# EAGLE design atmel_midi_cv_2layer (EAGLE 8.3.2)
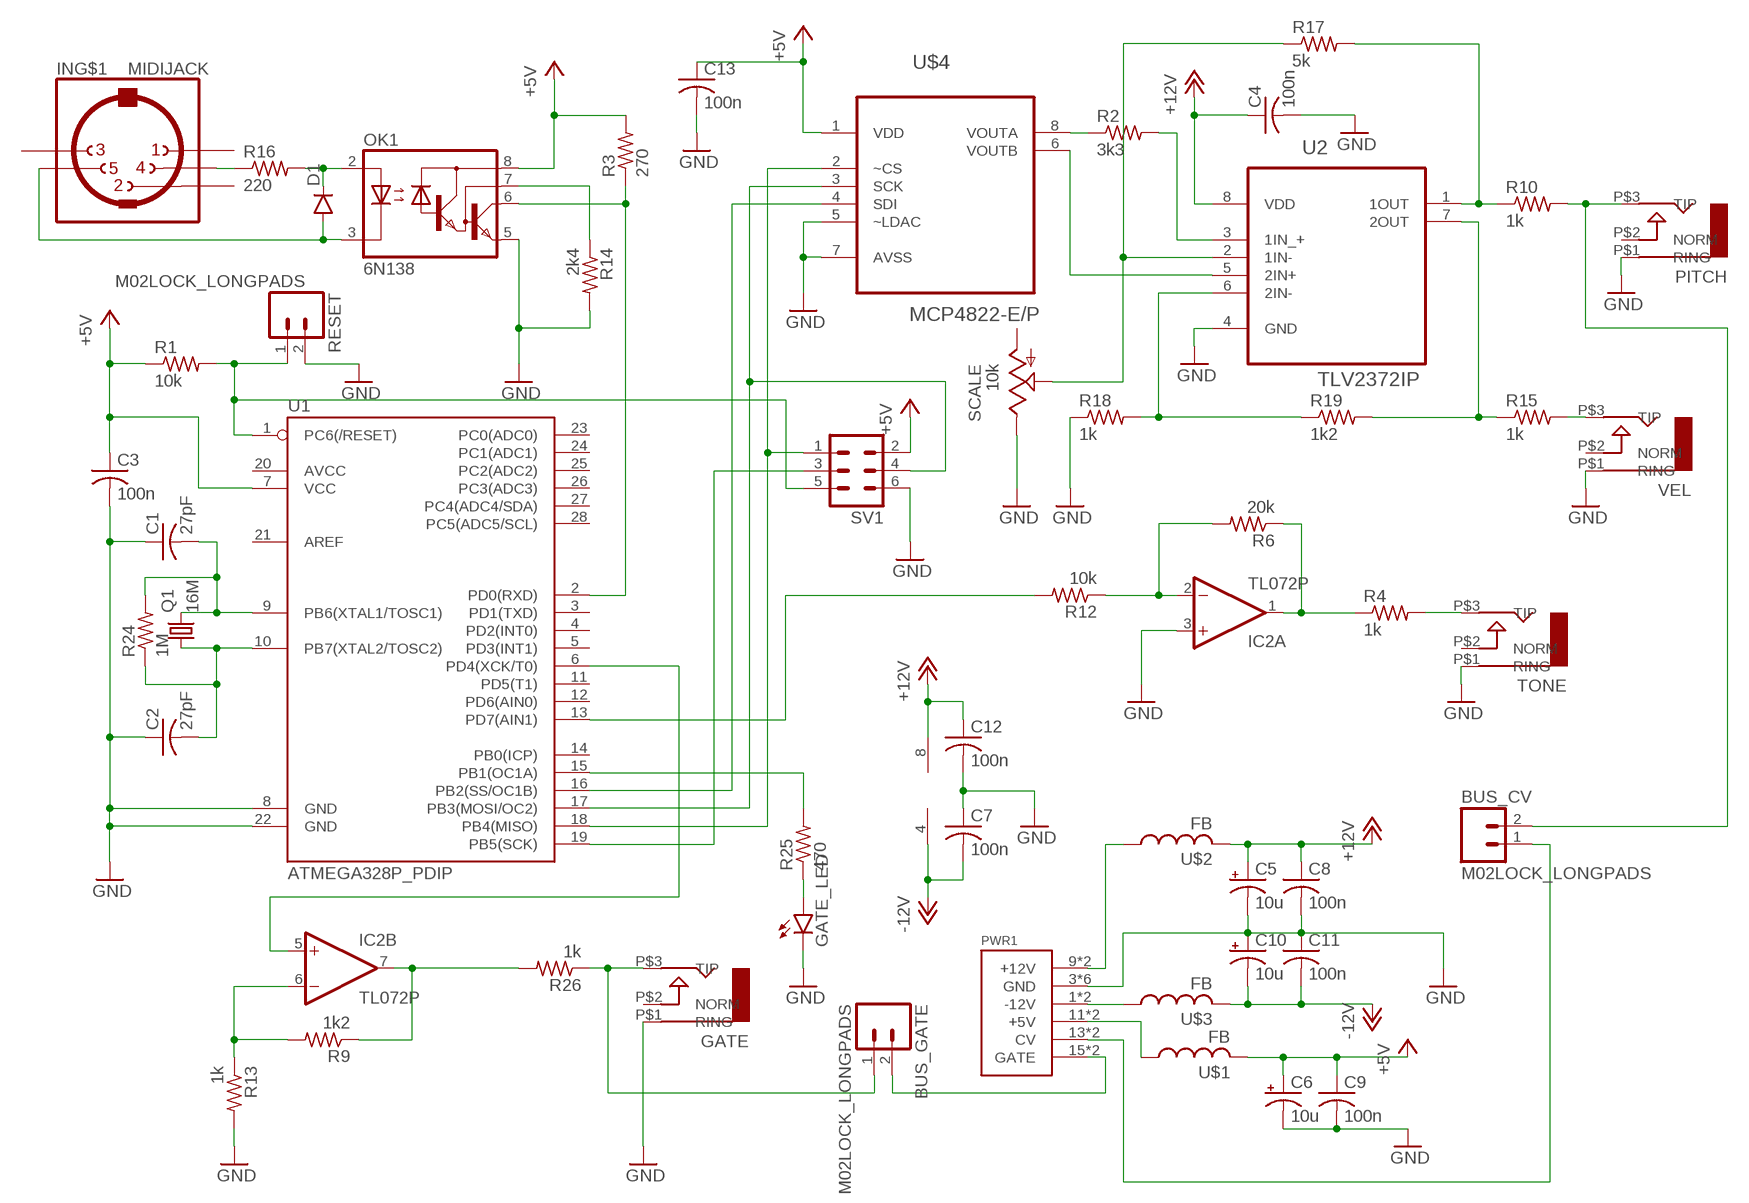
[diagram p0: schematic, sheet 1]

## Parts
BUS_CV  M02LOCK_LONGPADS  [1X02_LOCK_LONGPADS]
BUS_GATE  M02LOCK_LONGPADS  [1X02_LOCK_LONGPADS]
C1  27pF  C-US025-040X050  [C025-040X050]
C2  27pF  C-US025-040X050  [C025-040X050]
C3  100n  C-US050-024X044  [C050-024X044]
C4  100n  C-US050-024X044  [C050-024X044]
C5  10u  CPOL-USB45181A  [B45181A]
C6  10u  CPOL-USB45181A  [B45181A]
C7  100n  C-US050-024X044  [C050-024X044]
C8  100n  C-US050-024X044  [C050-024X044]
C9  100n  C-US050-024X044  [C050-024X044]
C10  10u  CPOL-USB45181A  [B45181A]
C11  100n  C-US050-024X044  [C050-024X044]
C12  100n  C-US050-024X044  [C050-024X044]
C13  100n  C-US050-024X044  [C050-024X044]
D1  DIODE1N4148  [DIODE-1N4148]
GATE  AUDIO-JACKITEAD  [JACK-90DEG-ITEAD]
GATE_LED  LED3MM  [LED3MM]
IC2  TL072P  [DIL08]
IN  MIDIJACK  [CP-2350]
OK1  6N138  [DIL08]
PITCH  AUDIO-JACKITEAD  [JACK-90DEG-ITEAD]
PWR1  POWER  [POWER_16]
Q1  16M  CRYSTALHC49S  [HC49/S]
R1  10k  R-US_0207/7  [0207/7]
R2  3k3  R-US_0207/7  [0207/7]
R3  270  R-US_0207/7  [0207/7]
R4  1k  R-US_0207/7  [0207/7]
R6  20k  R-US_0207/7  [0207/7]
R9  1k2  R-US_0207/7  [0207/7]
R10  1k  R-US_0207/7  [0207/7]
R12  10k  R-US_0207/7  [0207/7]
R13  1k  R-US_0207/7  [0207/7]
R14  2k4  R-US_0207/7  [0207/7]
R15  1k  R-US_0207/7  [0207/7]
R16  220  R-US_0207/7  [0207/7]
R17  5k  R-US_0207/7  [0207/7]
R18  1k  R-US_0207/7  [0207/7]
R19  1k2  R-US_0207/7  [0207/7]
R24  1M  R-US_0207/7  [0207/7]
R25  470  R-US_0207/7  [0207/7]
R26  1k  R-US_0207/7  [0207/7]
RESET  M02LOCK_LONGPADS  [1X02_LOCK_LONGPADS]
SCALE  10k  TRIM_US-B64W  [B64W]
SV1  MA03-2  [MA03-2]
TONE  AUDIO-JACKITEAD  [JACK-90DEG-ITEAD]
U1  ATMEGA328P_PDIP  [DIL28-3]
U2  TLV2372IP  [DIP254P762X508-8]
U$1  FB  [FB]
U$2  FB  [FB]
U$3  FB  [FB]
U$4  MCP4822-E/P  [DIP254P762X432-8]
VEL  AUDIO-JACKITEAD  [JACK-90DEG-ITEAD]

## Nets
+5V: C3.1 C6.+ C9.1 C13.1 OK1.8(VCC) R1.1 R3.2 SV1.2 U1.7(VCC) U$1.P$2 U$4.1(VDD)
+12V: C4.1 C5.+ C8.1 C12.1 IC2.8(P:V+) U2.8(VDD) U$2.P$2
-12V: C7.2 C10.- C11.2 IC2.4(P:V-) U$3.P$2
GND: C1.1 C2.1 C3.2 C4.2 C5.- C6.- C7.1 C8.2 C9.2 C10.+ C11.1 C12.2 C13.2 GATE.P$1(RING) GATE_LED.K(C) IC2.3(A:+IN) OK1.5(GND) PITCH.P$1(RING) PWR1.3(GND) PWR1.4(GND) PWR1.5(GND) PWR1.6(GND) PWR1.7(GND) PWR1.8(GND) R13.2 R14.2 R18.1 RESET.2 SCALE.E SV1.6 TONE.P$1(RING) U1.8(GND) U1.22(GND) U2.4(GND) U$4.5(~LDAC) U$4.7(AVSS) VEL.P$1(RING)
N$1: BUS_GATE.2 PWR1.15(GATE) PWR1.16(GATE)
N$2: SV1.3 U1.19(PB5(SCK))
N$4: C1.2 Q1.2 R24.2 U1.9(PB6(XTAL1/TOSC1))
N$5: C2.2 Q1.1 R24.1 U1.10(PB7(XTAL2/TOSC2))
N$7: D1.C OK1.2(A) R16.2
N$8: IN.4 R16.1
N$9: BUS_CV.2 PITCH.P$3(TIP) R10.2
N$10: IC2.6(B:-IN) R9.2 R13.1
N$11: PWR1.9(+12V) PWR1.10(+12V) U$2.P$1
N$15: BUS_CV.1 PWR1.13(CV) PWR1.14(CV)
N$16: IC2.7(B:OUT) R9.1 R26.2
N$17: PWR1.1(-12V) PWR1.2(-12V) U$3.P$1
N$18: GATE_LED.A R25.1
N$19: R15.2 VEL.P$3(TIP)
N$20: R25.2 U1.15(PB1(OC1A))
N$21: R12.2 U1.13(PD7(AIN1))
N$22: IC2.5(B:+IN) U1.6(PD4(XCK/T0))
N$23: R2.1 U$4.8(VOUTA)
N$24: R4.2 TONE.P$3(TIP)
N$25: SV1.4 U1.17(PB3(MOSI/OC2)) U$4.3(SCK)
N$26: U1.16(PB2(SS/OC1B)) U$4.4(SDI)
N$28: IC2.2(A:-IN) R6.2 R12.1
N$30: OK1.6(VO) R3.1 U1.2(PD0(RXD))
N$31: BUS_GATE.1 GATE.P$3(TIP) R26.1
N$32: OK1.7(VB) R14.1
N$33: D1.A IN.5 OK1.3(C)
N$34: PWR1.11(+5V) PWR1.12(+5V) U$1.P$1
N$35: IC2.1(A:OUT) R4.1 R6.1
N$36: R2.2 U2.3(1IN_+)
N$37: R17.1 SCALE.P$1(S) SCALE.S U2.2(1IN-)
N$38: R18.2 R19.1 U2.6(2IN-)
N$39: R15.1 R19.2 U2.7(2OUT)
N$40: U2.5(2IN+) U$4.6(VOUTB)
N$41: R10.1 R17.2 U2.1(1OUT)
N$43: R1.2 RESET.1 SV1.5 U1.1(PC6(/RESET))
N$45: SV1.1 U1.18(PB4(MISO)) U$4.2(~CS)
Unconnected: GATE.P$2(NORM) IN.1 IN.2 IN.3 IN.PE1(MT) IN.PE2(MT) IN.PE(MT) IN.PE@(MT) PITCH.P$2(NORM) SCALE.A TONE.P$2(NORM) U1.3(PD1(TXD)) U1.4(PD2(INT0)) U1.5(PD3(INT1)) U1.11(PD5(T1)) U1.12(PD6(AIN0)) U1.14(PB0(ICP)) U1.20(AVCC) U1.21(AREF) U1.23(PC0(ADC0)) U1.24(PC1(ADC1)) U1.25(PC2(ADC2)) U1.26(PC3(ADC3)) U1.27(PC4(ADC4/SDA)) U1.28(PC5(ADC5/SCL)) VEL.P$2(NORM)

## Library data of the parts
BUS_CV BUS_GATE RESET = SparkFun-Connectors:M02: Standard 2-pin 0.1" header. Use with - straight break away headers ( PRT-00116) - right angle break away headers (PRT-00553) - swiss pins (PRT-00743) - machine pins (PRT-00117) - female headers (PRT-00115) Molex polarized connector foot print use with: PRT-08233 with associated crimp pins and housings. 2.54_SCREWTERM for use with PRT-10571. 3.5mm Screw Terminal footprints for PRT-08084 5mm Screw Terminal footprints for use with PRT-08432
C1-C4 C7-C9 C11-C13 = rcl:C-US: CAPACITOR, American symbol
C5 C6 C10 = rcl:CPOL-US: POLARIZED CAPACITOR, American symbol
D1 = SparkFun-DiscreteSemi:DIODE: Diode These are standard reverse protection diodes and small signal diodes. SMA package can handle up to about 1A. SOD-323 can handle about 200mA. What the SOD-323 package when ordering, there are some mfgs out there that are 5-pin packages.
GATE PITCH TONE VEL = erthenvar:AUDIO-JACK: Switching Mono 3.5mm Audio Jack from Erthenvar.
GATE_LED = SparkFun-LED:LED: LEDs Standard schematic elements and footprints for 5mm, 3mm, 1206, and 0603 sized LEDs. 5mm - Spark Fun Electronics SKU : COM-00529 (and others)
IC2 = linear:TL072: OP AMP
IN = adafruit:MIDIJACK: DIN 5 jack also known as MIDI jack A modification of conn-hirshman:MAB5SH with two options for the grounding 'teeth'
OK1 = optocoupler:6N138: MOTOROLA OPTO COUPLER; MF: VISHAY/TELEFUNKEN; MPN: 6N138; OC_FARNELL: 9860150; OC_NEWARK: 35K5294
PWR1 = eurorack:POWER
Q1 = crystal:CRYSTAL: CRYSTAL; OC_FARNELL: 1667008; OC_NEWARK: unknown
R1-R4 R6 R9 R10 R12-R19 R24-R26 = rcl:R-US_: RESISTOR, American symbol
SCALE = pot:TRIM_US-: POTENTIOMETER
SV1 = con-lstb:MA03-2: PIN HEADER; OC_FARNELL: unknown; OC_NEWARK: unknown
U1 = SparkFun-DigitalIC:ATMEGA328P_PDIP: uC used in the Arduino 32kb flash, 1k EEPROM, 2k SRAM This is the through-hole version of this chip.
U2 = Texas Instruments_By_element14_Batch_1:TLV2372IP: OPERATIONAL AMPLIFIER; MPN: TLV2372IP; OC_FARNELL: 8455031; OC_NEWARK: 76C7976; PACKAGE: PDIP; SUPPLIER: Texas Instruments
U$1-U$3 = adafruit:FB: Ferrite bead Digikey #P9821BK-ND
U$4 = MCP4822:MCP4822-E/P: DAC; MPN: MCP4822-E/P; OC_FARNELL: 1439413; OC_NEWARK: 11M1705; PACKAGE: DIP-8; SUPPLIER: Microchip

## Net classes
1 GND: width 1.016 mm, drill 1.016 mm, clearance 0.508 mm

## Board
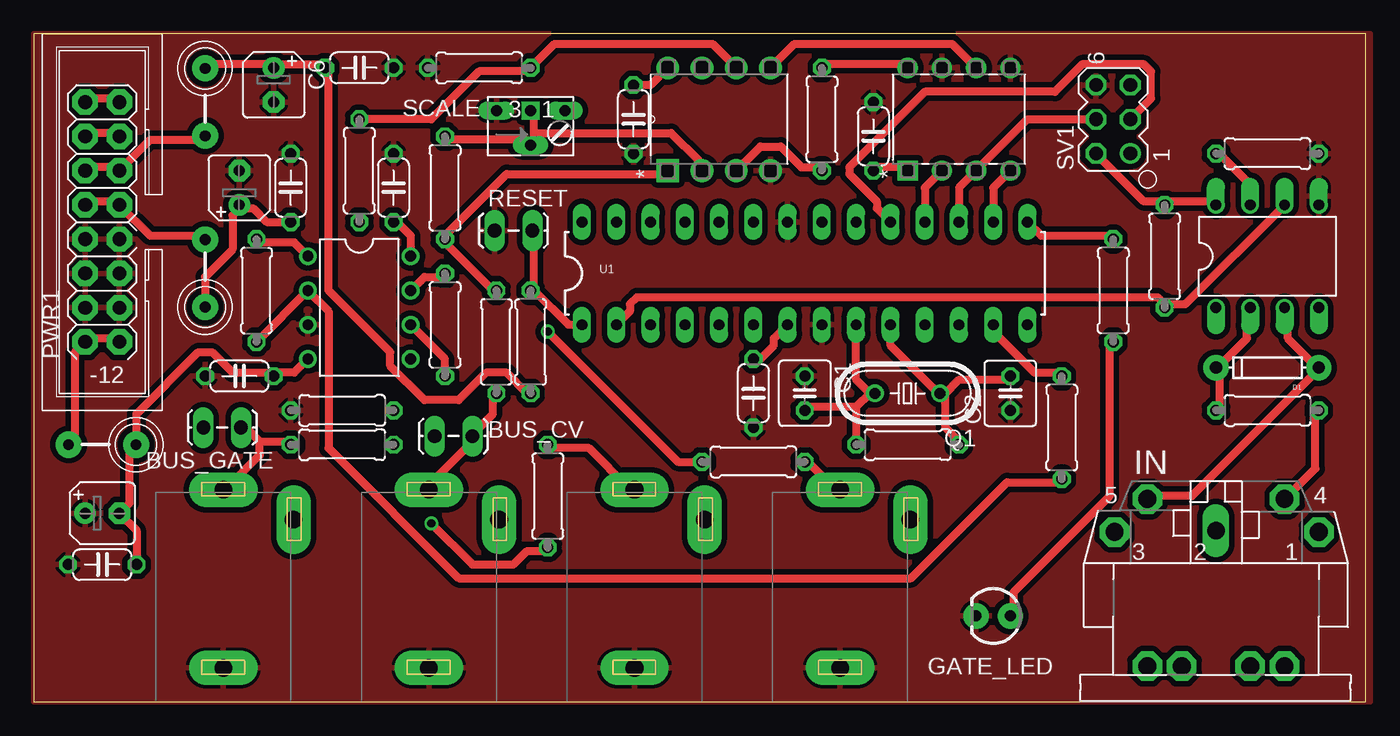
[diagram p1: board, top side]
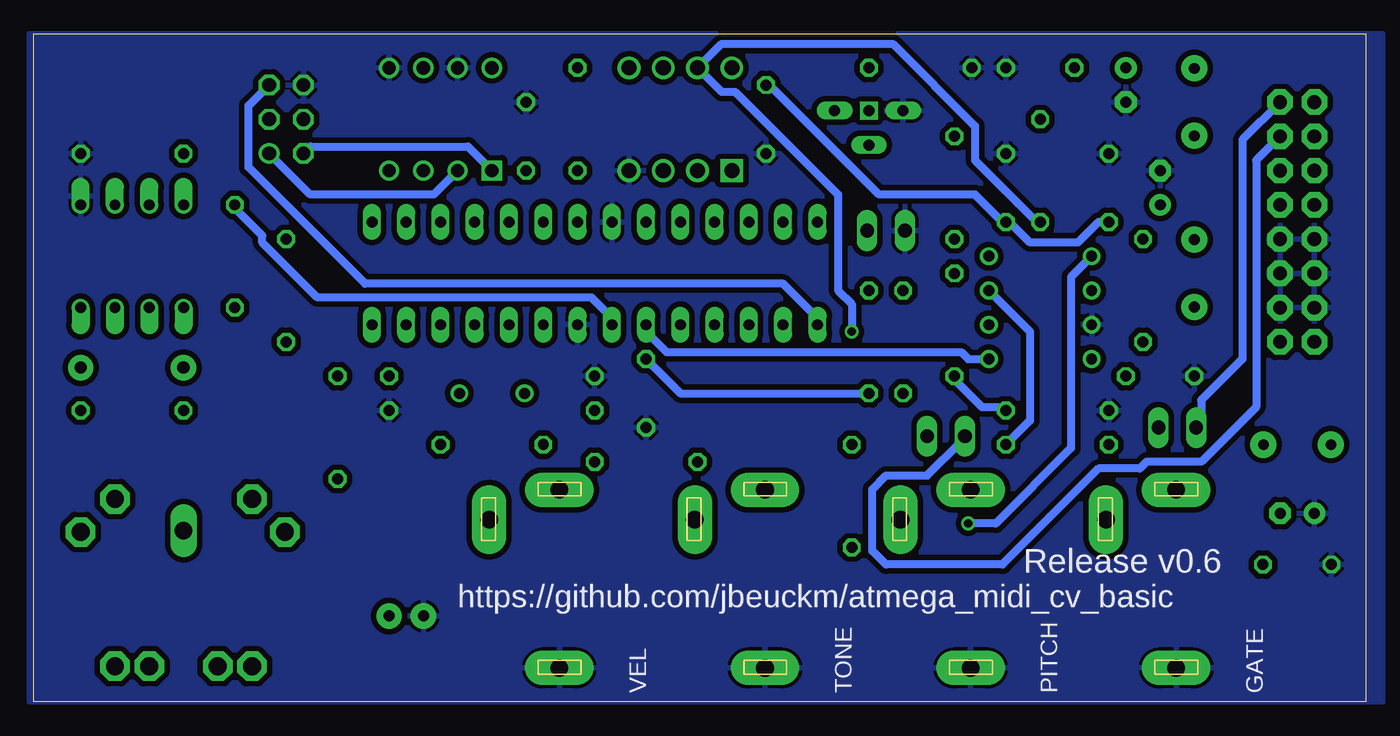
[diagram p2: board, bottom side, seen from below]

Size 98.73 x 49.52 mm. Coordinates in mm from the lower left corner, seen from the top.
Outline: 0,0 98.73,0 98.73,49.52 0,49.52 0,0
Copper layers (1*16): Top 0.035mm / dielectric 1.5mm / Bottom 0.035mm
Design rules "default *": minimum track width 24mil, minimum drill 24mil, track to track 16mil, track to pad 16mil, pad to pad 16mil, via to via 16mil, smd to smd 8mil, copper to edge 0mil, drill to drill 20mil, minimum pad ring 10mil, minimum via ring 8mil, stop-mask expansion 4mil, vias tented up to drill 0mil, thermal gap 10mil

### Footprints (pad centres in the part's own frame; a part is rotated, then mirrored left to right if it is on the bottom)
1X02_LOCK_LONGPADS = drill 1.016 long: 1 -0.127,0; 2 2.667,0
C025-040X050 = drill 0.813 octagon: 1 -1.27,0; 2 1.27,0
C050-024X044 = drill 0.813 octagon: 1 -2.54,0; 2 2.54,0
B45181A = drill 0.813 pad 1.6: + -1.27,0 | drill 0.813 pad 1.6 octagon: - 1.27,0
DIODE-1N4148 = drill 0.9 pad 1.88: A -3.81,0; C 3.81,0
JACK-90DEG-ITEAD = drill 1.3 pad 2.54 long: P$1 5,-2.5; P$2 -0.2,-13.5; P$3 5,-15.7
LED3MM = drill 0.813 pad 1.88: A -1.27,0; K 1.27,0
DIL08 = drill 0.813 pad 1.27: 1 -3.81,-3.81; 2 -1.27,-3.81; 3 1.27,-3.81; 4 3.81,-3.81; 5 3.81,3.81; 6 1.27,3.81; 7 -1.27,3.81; 8 -3.81,3.81
CP-2350 = drill 1.321 pad 2.184 octagon: 1 7.62,12.58; 3 -7.52,12.58; 4 5.08,15.02; 5 -5.08,15.02; PE -2.54,2.62; PE1 -5.08,2.62; PE2 5.08,2.62; PE@ 2.54,2.62 | drill 1.321 long: 2 0,12.68
DIL08' = drill 0.813 offset: 1 -3.81,-3.81; 2 -1.27,-3.81; 3 1.27,-3.81; 4 3.81,-3.81; 5 3.81,3.81; 6 1.27,3.81; 7 -1.27,3.81; 8 -3.81,3.81
POWER_16 = drill 1.016 pad 1.88 octagon: 1 -6.35,-1.27; 2 -6.35,1.27; 3 -3.81,-1.27; 4 -3.81,1.27; 5 -1.27,-1.27; 6 -1.27,1.27; 7 1.27,-1.27; 8 1.27,1.27; 9 3.81,-1.27; 10 3.81,1.27; 11 6.35,-1.27; 12 6.35,1.27; 13 8.89,-1.27; 14 8.89,1.27; 15 11.43,-1.27; 16 11.43,1.27
HC49/S = drill 0.813: 1 -2.413,0; 2 2.413,0
0207/7 = drill 0.813 octagon: 1 -3.81,0; 2 3.81,0
B64W = drill 0.813 long: A 2.54,0; E -2.54,0; S 0,-2.54 | drill 0.8 square: P$1 0,0
MA03-2 = drill 1.016: 1 -2.54,-1.27 | drill 1.016 octagon: 2 -2.54,1.27; 3 0,-1.27; 4 0,1.27; 5 2.54,-1.27; 6 2.54,1.27
DIL28-3 = drill 0.813 long: 1 -16.51,-3.81; 2 -13.97,-3.81; 3 -11.43,-3.81; 4 -8.89,-3.81; 5 -6.35,-3.81; 6 -3.81,-3.81; 7 -1.27,-3.81; 8 1.27,-3.81; 9 3.81,-3.81; 10 6.35,-3.81; 11 8.89,-3.81; 12 11.43,-3.81; 13 13.97,-3.81; 14 16.51,-3.81; 15 16.51,3.81; 16 13.97,3.81; 17 11.43,3.81; 18 8.89,3.81; 19 6.35,3.81; 20 3.81,3.81; 21 1.27,3.81; 22 -1.27,3.81; 23 -3.81,3.81; 24 -6.35,3.81; 25 -8.89,3.81; 26 -11.43,3.81; 27 -13.97,3.81; 28 -16.51,3.81
DIP254P762X508-8 = drill 1.118 square: 1 -7.62,7.62 | drill 1.118: 2 -7.62,5.08; 3 -7.62,2.54; 4 -7.62,0; 5 0,0; 6 0,2.54; 7 0,5.08; 8 0,7.62
FB = drill 0.8 pad 1.93: P$1 -2.5,0; P$2 2.5,0
DIP254P762X432-8 = drill 0.991 square: 1 -7.62,7.62 | drill 0.991: 2 -7.62,5.08; 3 -7.62,2.54; 4 -7.62,0; 5 0,0; 6 0,2.54; 7 0,5.08; 8 0,7.62

### Placement (x,y rotation side)
BUS_CV  29.84,19.68 0 top
BUS_GATE  15.24,20.32 180 top
C1  57.15,22.86 270 top
C2  72.39,22.86 90 top
C3  53.34,22.86 270 top
C4  44.45,43.18 270 top
C5  15.24,38.1 90 top
C6  17.78,45.72 270 top
C7  15.24,24.13 0 top
C8  19.05,38.1 90 top
C9  24.13,46.99 0 top
C10  5.08,13.97 0 top
C11  5.08,10.16 0 top
C12  26.67,38.1 90 top
C13  62.23,41.91 90 top
D1  91.44,24.77 180 top
GATE  19.05,0 180 top
GATE_LED  71.12,6.35 180 top
IC2  24.13,29.21 270 top
IN  87.63,0 0 top
OK1  6N138  [DIL08']  91.44,33.02 0 top
PITCH  34.29,0 180 top
PWR1  5.08,33.02 90 top
Q1  64.77,22.86 180 top
R1  36.83,26.67 90 top
R2  58.42,43.18 270 top
R3  83.82,33.02 90 top
R4  38.1,15.24 90 top
R6  16.51,30.48 270 top
R9  30.48,27.94 270 top
R10  34.29,26.67 270 top
R12  76.2,20.32 90 top
R13  22.86,21.59 180 top
R14  91.44,40.64 0 top
R15  53.34,17.78 0 top
R16  91.44,21.59 180 top
R17  30.48,38.1 270 top
R18  33.02,46.99 0 top
R19  24.13,39.37 270 top
R24  64.77,19.05 180 top
R25  80.01,30.48 90 top
R26  22.86,19.05 0 top
RESET  36.83,34.92 180 top
SCALE  36.83,43.81 0 top
SV1  80.01,43.18 90 top
TONE  49.53,0 180 top
U1  57.15,31.75 0 top
U2  54.61,46.99 90 top
U$1  12.7,44.45 90 top
U$2  12.7,31.75 270 top
U$3  5.08,19.05 0 top
U$4  72.39,46.99 90 top
VEL  64.77,0 180 top

### Tracks (layer width: path | path; a pad name or v marks a point on that pad's centre or on a via)
+5V
  Top 0.61: C13.1 62.48,39.62 64.52,39.62 U$4.1 | 83.82,37.08 87.38,37.08 OK1.8 | SV1.2 82.3,37.08 83.82,37.08 | 83.82,37.08 R3.2 | 17.78,47.24 21.34,47.24 C9.1 21.84,46.74 21.84,30.48 26.42,25.91 26.42,24.89 28.96,22.35 31.5,22.35 33.53,24.38 35.05,24.38 36.58,22.86 R1.1 | 17.78,47.24 12.7,47.24 U$1.P$2 | 17.78,47.24 C6.+ | U1.7 54.86,26.92 54.86,26.42 53.85,25.4 C3.1
  Bottom 0.61: U$4.1 66.55,41.15 78.23,41.15 SV1.2 | R1.1 50.8,22.86 C3.1 | U1.7 55.88,28.45 57.4,29.97 77.72,29.97 81.79,34.04 81.79,34.54 83.82,36.58 R3.2
+12V
  Top 0.61: C4.1 45.72,45.72 U2.8 | IC2.8 27.94,34.54 26.92,35.56 C12.1 | C8.1 17.27,35.56 16.26,36.58 15.24,36.58 | U$2.P$2 12.7,31.5 14.73,33.53 14.73,36.07 15.24,36.58 | 15.24,36.58 C5.+
  Bottom 0.61: C8.1 19.81,35.56 21.34,34.04 24.89,34.04 26.42,35.56 C12.1 26.92,35.56 28.96,37.59 36.07,37.59 44.2,45.72 C4.1
-12V
  Top 0.61: 17.78,24.38 19.3,24.38 IC2.4 | C11.2 7.62,12.7 C10.- 7.11,14.73 7.11,18.8 U$3.P$2 7.62,19.3 7.62,21.34 12.19,25.91 13.21,25.91 14.73,24.38 17.78,24.38 | 17.78,24.38 C7.2
GND
  pour Top: 0,49.53 99.06,49.53 99.06,0 0,0
  pour Bottom: -1.27,49.53 99.06,49.53 99.06,0 -1.27,0
N$1
  Top 0.61: PWR1.16 4.06,44.7 6.1,44.7 PWR1.15
  Bottom 0.61: PWR1.15 9.14,41.66 9.14,25.4 12.19,22.35 12.19,20.32 BUS_GATE.2
N$2
  Top 0.61: U1.19 62.48,36.58 62.48,37.08 60.45,39.12 60.45,39.62 66.04,45.21 75.69,45.21 77.72,47.24 82.3,47.24 82.8,46.74 82.8,44.7 SV1.3
N$4
  Top 0.61: 60.96,21.84 R24.2 | 61.98,22.86 60.96,21.84 | 60.96,21.84 57.4,21.84 C1.2 | U1.9 60.96,23.88 61.98,22.86 | 61.98,22.86 Q1.2
N$5
  Top 0.61: 67.56,22.86 67.56,20.32 68.58,19.3 R24.1 | U1.10 63.5,26.42 67.06,22.86 Q1.1 67.56,22.86 | 67.56,22.86 68.58,23.88 72.14,23.88 C2.2
N$7
  Top 0.61: R16.2 87.88,21.84 87.88,24.38 D1.C 87.88,24.89 89.92,26.92 89.92,28.96 OK1.2
N$8
  Top 0.61: R16.1 95,21.34 95,17.27 92.96,15.24 IN.4
N$9
  Top 0.61: R10.2 34.04,22.86 34.04,21.34 32.51,19.81 BUS_CV.2 32.51,19.3 28.96,15.75 PITCH.P$3
N$10
  Top 0.61: IC2.6 30.48,25.4 R9.2
  Bottom 0.61: R13.1 26.92,21.84 28.45,21.84 30.48,23.88 R9.2
N$11
  Top 0.61: PWR1.10 4.06,37.08 6.1,37.08 PWR1.9 8.64,34.54 12.7,34.54 U$2.P$1
N$15
  Top 0.61: PWR1.14 4.06,42.16 6.1,42.16 PWR1.13
  Bottom 0.61: PWR1.13 8.13,40.13 8.13,21.84 12.19,17.78 16.26,17.78 16.76,17.27 19.81,17.27 26.92,10.16 35.56,10.16 36.58,11.18 36.58,15.75 35.56,16.76 32.51,16.76 29.97,19.3 BUS_CV.1
N$16
  Top 0.61: IC2.7 28.96,31.5 30.48,31.5 R9.1
  Bottom 0.61: R26.2 24.89,20.83 24.89,27.43 IC2.7
N$17
  Top 0.61: PWR1.1 6.1,26.92 4.06,26.92 PWR1.2 3.05,25.91 3.05,19.3 U$3.P$1
N$18
  Top 0.61: R25.1 79.76,26.42 79.76,15.24 72.64,8.13 72.64,6.6 GATE_LED.A
N$19
  Top 0.61: R15.2 57.4,17.78 59.44,15.75 VEL.P$3
N$20
  Top 0.61: U1.15 74.68,34.54 79.76,34.54 R25.2
N$21
  Top 0.61: U1.13 71.12,27.43 74.17,24.38 76.2,24.38 R12.2
N$22
  Bottom 0.61: IC2.5 29.46,25.4 29.97,25.91 51.82,25.91 53.34,27.43 U1.6
N$23
  Top 0.61: R2.1 58.42,47.24 64.52,47.24 U$4.8
N$24
  Top 0.61: R4.2 38.1,18.8 41.15,18.8 44.2,15.75 TONE.P$3
N$25
  Top 0.61: U1.17 68.58,38.1 U$4.3 73.66,43.18 SV1.4
N$26
  Top 0.61: U1.16 71.12,38.1 U$4.4
N$28
  Top 0.61: R6.2 IC2.2 21.84,28.96 21.84,18.8 31.5,9.14 65.02,9.14 72.14,16.26 76.2,16.26 R12.1
N$30
  Top 0.61: U1.2 44.2,28.96 44.2,29.46 44.7,29.97 83.31,29.97 83.82,29.46 | OK1.6 85.34,29.46 83.82,29.46 | 83.82,29.46 R3.1
N$31
  Top 0.61: 16.76,19.3 18.8,19.3 R26.1 | 16.76,19.3 15.75,20.32 BUS_GATE.1 | 16.76,19.3 16.76,18.29 14.22,15.75 GATE.P$3
N$32
  Top 0.61: R14.1 87.88,40.64 89.92,38.61 89.92,37.08 OK1.7
N$33
  Top 0.61: OK1.3 92.96,28.96 92.96,26.92 95,24.89 D1.A 95,24.38 85.85,15.24 82.8,15.24 IN.5
N$34
  Top 0.61: PWR1.12 4.06,39.62 6.1,39.62 PWR1.11 8.64,41.66 12.7,41.66 U$1.P$1
N$35  (via drill 0.61)
  Top 0.61: IC2.1 19.3,34.04 16.76,34.04 R6.1 | v29.46,13.21 32.51,10.16 35.56,10.16 36.58,11.18 38.1,11.18 R4.1
  Bottom 0.61: v29.46,13.21 27.43,13.21 21.84,18.8 21.84,31.5 IC2.1
N$36
  Top 0.61: U2.3 53.85,41.15 55.37,41.15 56.9,39.62 58.42,39.62 R2.2
N$37
  Top 0.61: 37.08,42.16 37.08,41.66 SCALE.S 36.58,41.66 30.48,41.66 R17.1 | 37.08,42.16 37.08,43.69 SCALE.P$1 | 37.08,42.16 47.24,42.16 49.28,40.13 49.28,39.62 U2.2
N$38
  Top 0.61: R19.1 29.46,43.18 33.02,46.74 36.58,46.74 R18.2 38.61,48.77 50.29,48.77 U2.6
N$39  (via drill 0.61)
  Top 0.61: R15.1 47.75,17.78 v38.1,27.43
  Bottom 0.61: v38.1,27.43 38.1,29.46 39.12,30.48 39.12,37.59 46.74,45.21 47.75,45.21 U2.7 47.75,48.77 35.05,48.77 28.96,42.67 28.96,40.13 24.38,35.56 R19.2
N$40
  Top 0.61: U$4.6 68.07,48.77 56.39,48.77 U2.5
N$41
  Top 0.61: R10.1 34.04,30.48 30.48,34.04 R17.2 30.48,34.54 35.05,39.12 46.74,39.12 U2.1
N$43
  Top 0.61: U1.1 39.62,27.94 37.08,30.48 | 37.08,30.48 37.08,34.54 RESET.1 | 37.08,30.48 R1.2
  Bottom 0.61: SV1.5 82.8,44.2 82.8,39.62 74.17,30.99 43.18,30.99 40.64,28.45 U1.1
N$45
  Top 0.61: U1.18 66.04,38.1 U$4.2
  Bottom 0.61: SV1.1 78.23,37.59 69.09,37.59 U$4.2

### Text on the board
bNames: Release v0.6 | https://github.com/jbeuckm/atmega_midi_cv_basic